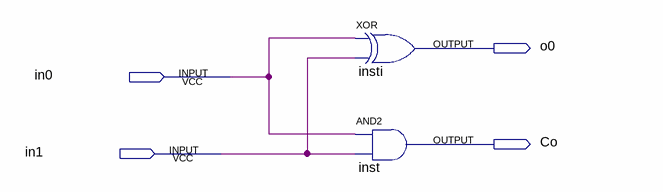
[diagram p0: schematic sheet]
// Quartus schematic ha.bdf as structural Verilog: 2 symbols, 4 pins
module ha (
  input  in0,
  input  in1,
  output o0,
  output Co
);

  xor insti (o0, in0, in1);
  and inst (Co, in0, in1);
endmodule
